# Altium schematic sheet 200_Peripherals_Sensors.SchDoc
size A; SheetNumber: 4; SheetTotal: 5
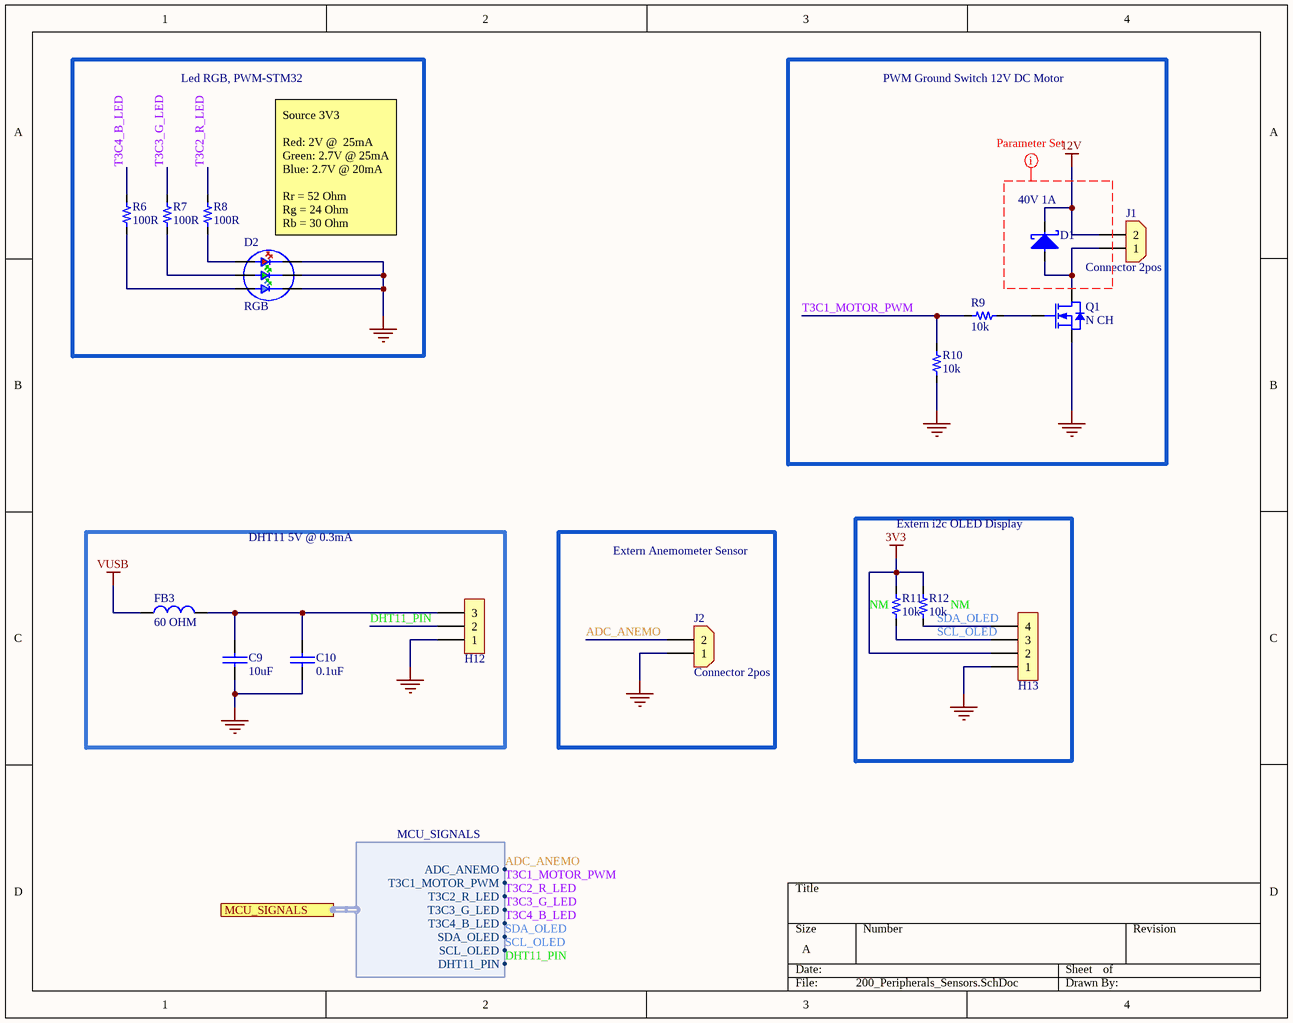
[diagram p0: 200_Peripherals_Sensors.SchDoc]

## Parts
C9  value 10uF  [0805_cap]  (hidden comment: 10uF 25V)
C10  value 0.1uF  [0603_cap]  (hidden comment: 0.1uF 50V)
D1  40V 1A  [SOD_123]
D2  RGB  [RGB_NS_3.5X3.7]
FB3  value 60 OHM  [0603_fb]  (hidden comment: 60OHM 2A)
H12  3x1  [H_3X1_TH_100mil]  (value not drawn)  (no BOM)
H13  4x1  [H_4x1_TH_2.54mm]  (value not drawn)  (no BOM)
J1  Connector 2pos  [CON_2x1_TH_5MM]
J2  Connector 2pos  [CON_2x1_TH_5MM]
Q1  N CH  [SOT_23_3]
R6  value 100R  [0603_res]  (hidden comment: 100R 1/10W)
R7  value 100R  [0603_res]  (hidden comment: 100R 1/10W)
R8  value 100R  [0603_res]  (hidden comment: 100R 1/10W)
R9  value 10k  [0603_res]  (hidden comment: 10k 1/10W)
R10  value 10k  [0603_res]  (hidden comment: 10k 1/10W)
R11  value 10k  Usage: NM  [0603_res]  (hidden comment: 10k 1/10W)
R12  value 10k  Usage: NM  [0603_res]  (hidden comment: 10k 1/10W)

## Blocks framed on the sheet
Led RGB, PWM-STM32: D2 R6-R8
PWM Ground Switch 12V DC Motor: D1 J1 Q1 R9 R10
DHT11 5V @ 0.3mA: C9 C10 FB3 H12
Extern Anemometer Sensor: J2
Extern i2c OLED Display: H13 R11 R12

## Ports
MCU_SIGNALS (harness MCU_SIGNALS, see Main[3B], 000_STM[3D])

## Harnesses
MCU_SIGNALS: ADC_ANEMO, T3C1_MOTOR_PWM, T3C2_R_LED, T3C3_G_LED, T3C4_B_LED, SDA_OLED, SCL_OLED, DHT11_PIN

## Nets
3V3: H13.2 R11.2 R12.2
12V: D1.1 J1.2
GND: C9.2 C10.2 D2.1 D2.2 D2.3 H12.1 H13.1 J2.1 Q1.2(S) R10.1
VUSB: FB3.1
ADC_ANEMO: J2.2 ; port MCU_SIGNALS.ADC_ANEMO
DHT11_PIN: H12.2 ; port MCU_SIGNALS.DHT11_PIN
SCL_OLED: H13.3 R11.1 ; port MCU_SIGNALS.SCL_OLED
SDA_OLED: H13.4 R12.1 ; port MCU_SIGNALS.SDA_OLED
T3C1_MOTOR_PWM: R9.2 R10.2 ; port MCU_SIGNALS.T3C1_MOTOR_PWM
T3C2_R_LED: R8.2 ; port MCU_SIGNALS.T3C2_R_LED
T3C3_G_LED: R7.2 ; port MCU_SIGNALS.T3C3_G_LED
T3C4_B_LED: R6.2 ; port MCU_SIGNALS.T3C4_B_LED
NetC9_1: C9.1 C10.1 FB3.2 H12.3
NetD1_2: D1.2 J1.1 Q1.3(D)
NetD2_4: D2.4 R8.1
NetD2_5: D2.5 R7.1
NetD2_6: D2.6 R6.1
NetQ1_1: Q1.1(G) R9.1

## Layout directives
net class 12V_2A: (no net found under the mark)

## Notes on the sheet
- (near D2) Source 3V3
  Red: 2V @  25mA
  Green: 2.7V @ 25mA
  Blue: 2.7V @ 20mA
  Rr = 52 Ohm
  Rg = 24 Ohm
  Rb = 30 Ohm

## Library data of the parts
C9 = Cap_10uF_0805_25V_: 25V 10uF X5R ±10% 0805 Multilayer Ceramic Capacitors MLCC - SMD/SMT ROHS; Manufacturer: Samsung Electro-Mechanics; Manufacturer Part Number: CL21A106KAYNNNE; Supplier 1: LCSC; Supplier Part Number 1: C15850; ComponentLink1Description: LCSC; ComponentLink1URL: https://lcsc.com/product-detail/Multilayer-Ceramic-Capacitors-MLCC-SMD-SMT_Samsung-Electro-Mechanics-CL21A106KAYNNNE_C15850.html
C10 = Cap_0.1uF_0603_50V: 50V 100nF Y5V -20%~+80% 0603 Multilayer Ceramic Capacitors MLCC - SMD/SMT ROHS; Manufacturer: Walsin Tech Corp; Manufacturer Part Number: 0603F104Z500CT; Supplier 1: LCSC; Supplier Part Number 1: C83060; ComponentLink1Description: LCSC; ComponentLink1URL: https://www.lcsc.com/product-detail/Multilayer-Ceramic-Capacitors-MLCC-SMD-SMT_Walsin-Tech-Corp-0603F104Z500CT_C83060.html
D1 = D_Schottky_40V_1A_SOD_123F: DIODE SCHOTTKY 40V 1A SOD123F; Manufacturer: Shanghai Prisemi Elec; Manufacturer Part Number: PSBD1DF40V1H; Supplier 1: LCSC; Supplier Part Number 1: C110730; ComponentLink1Description: LCSC; ComponentLink1URL: https://www.lcsc.com/product-detail/Switching-Diode_Shanghai-Prisemi-Elec-PSBD1DF40V1H_C110730.html
D2 = LED_RGB_3535_SMD: -30℃~+85℃ RGB 110° 3535(mm) Light Emitting Diodes (LED) ROHS; Manufacturer: Foshan NationStar Optoelectronics; Manufacturer Part Number: RS-3535MWAM; Supplier 1: LCSC; Supplier Part Number 1: C842778; ComponentLink1Description: LCSC; ComponentLink1URL: https://www.lcsc.com/product-detail/Light-Emitting-Diodes-LED_Foshan-NationStar-Optoelectronics-RS-3535MWAM_C842778.html
FB3 = FB_60_0603_2A: 2A 1 100mΩ 60Ω@100MHz ±25% 0603 Ferrite Beads ROHS; Manufacturer: TAI-TECH; Manufacturer Part Number: HCB1608KF-600T20; ComponentLink1Description: LCSC; ComponentLink1URL: https://www.lcsc.com/product-detail/Ferrite-Beads_TAI-TECH-HCB1608KF-600T20_C369516.html; Supplier 1: LCSC; Supplier Part Number 1: C369516
H12 = H_Male_3x1_TH_100mil: ComponentLink1Description: LCSC
H13 = H_Male_4x1_TH_100mil: ComponentLink1Description: LCSC
J1 J2 = Con_2x1_TH_5mm: 2POS 5MM; Manufacturer: JILN; Manufacturer Part Number: JL126-50002G01; Supplier 1: LCSC; Supplier Part Number 1: C394556; ComponentLink1Description: Digi-Key; ComponentLink1URL: https://www.lcsc.com/product-detail/Screw-terminal_JILN-JL126-50002G01_C394556.html
Q1 = Q_NFET_20V_3.2A_SOT23: MOSFET N-CH 20V SOT23; Manufacturer: Doeshare; Manufacturer Part Number: DN2302S; Supplier 1: LCSC; Supplier Part Number 1: C2931750; ComponentLink1Description: LCSC; ComponentLink1URL: https://www.lcsc.com/product-detail/MOSFETs_Doeshare-DN2302S_C2931750.html
R6-R8 = Res_100R_0603_1/10W: RES SMD 100R OHM 5% 1/10W 0603; Manufacturer: FOJAN; Manufacturer Part Number: FRC0603J101 TS; ComponentLink1URL: https://www.lcsc.com/product-detail/Chip-Resistor-Surface-Mount_FOJAN-FRC0603J101-TS_C2907089.html; Supplier 1: LCSC; Supplier Part Number 1: C2907089; ComponentLink1Description: LCSC
R9-R12 = Res_10k_0603_1/10W: RES SMD 10k OHM 5% 1/10W 0603; Manufacturer: FOJAN; Manufacturer Part Number: FRC0603J103TS; ComponentLink1URL: https://www.lcsc.com/product-detail/Chip-Resistor-Surface-Mount_FOJAN-FRC0603J103TS_C2930027.html; Supplier 1: LCSC; Supplier Part Number 1: C2930027; ComponentLink1Description: LCSC